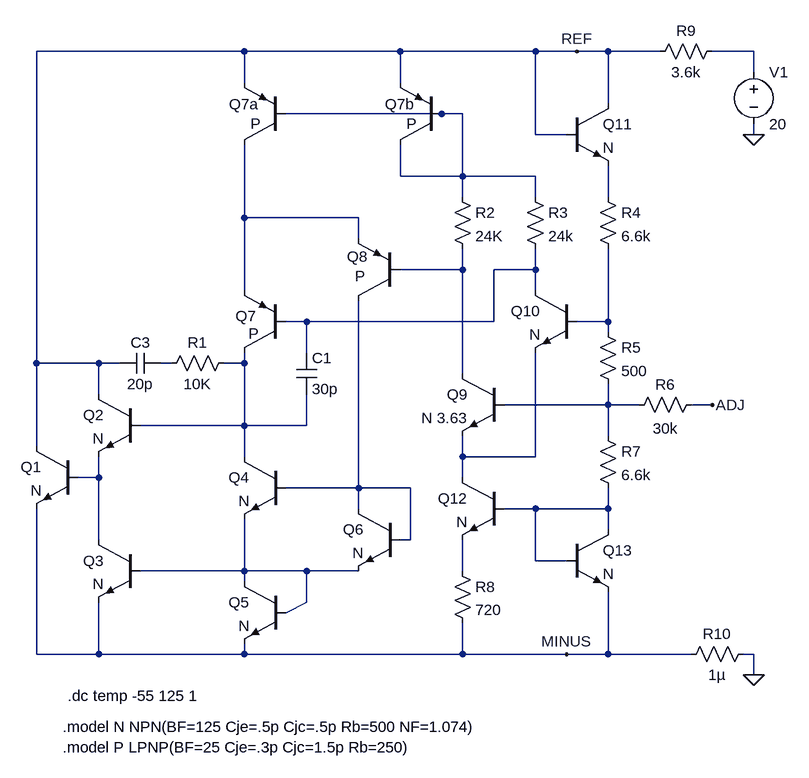
[diagram p0: schematic LT1009_rough_guess1.asc]
LT1009_rough_guess1.asc, the LTspice schematic file:
Version 4
SHEET 1 1268 716
WIRE -256 112 -256 -368
WIRE -256 240 -256 112
WIRE -256 560 -256 336
WIRE -160 112 -256 112
WIRE -160 160 -160 112
WIRE -160 288 -192 288
WIRE -160 288 -160 256
WIRE -160 384 -160 288
WIRE -160 560 -256 560
WIRE -160 560 -160 480
WIRE -128 112 -160 112
WIRE -48 112 -64 112
WIRE 64 -368 -256 -368
WIRE 64 -320 64 -368
WIRE 64 -112 64 -224
WIRE 64 0 64 -112
WIRE 64 112 32 112
WIRE 64 112 64 96
WIRE 64 208 -96 208
WIRE 64 208 64 112
WIRE 64 256 64 208
WIRE 64 432 -96 432
WIRE 64 432 64 352
WIRE 64 448 64 432
WIRE 64 560 -160 560
WIRE 64 560 64 544
WIRE 160 48 128 48
WIRE 160 96 160 48
WIRE 160 208 64 208
WIRE 160 208 160 160
WIRE 160 432 64 432
WIRE 160 480 128 496
WIRE 160 480 160 432
WIRE 240 -112 64 -112
WIRE 240 -80 240 -112
WIRE 240 304 128 304
WIRE 240 304 240 16
WIRE 240 336 240 304
WIRE 240 432 160 432
WIRE 304 -368 64 -368
WIRE 304 -320 304 -368
WIRE 304 -176 304 -224
WIRE 320 304 240 304
WIRE 320 384 304 384
WIRE 320 384 320 304
WIRE 368 -272 128 -272
WIRE 400 -272 368 -272
WIRE 400 -176 304 -176
WIRE 400 -176 400 -272
WIRE 400 -144 400 -176
WIRE 400 -32 304 -32
WIRE 400 -32 400 -64
WIRE 400 128 400 -32
WIRE 400 256 400 224
WIRE 400 288 400 256
WIRE 400 432 400 384
WIRE 400 560 64 560
WIRE 400 560 400 512
WIRE 448 48 160 48
WIRE 448 48 448 -32
WIRE 512 -368 304 -368
WIRE 512 -240 512 -368
WIRE 512 -176 400 -176
WIRE 512 -144 512 -176
WIRE 512 -32 448 -32
WIRE 512 -32 512 -64
WIRE 512 0 512 -32
WIRE 512 256 400 256
WIRE 512 256 512 96
WIRE 512 336 464 336
WIRE 512 416 512 336
WIRE 560 -240 512 -240
WIRE 560 416 512 416
WIRE 560 560 400 560
WIRE 576 -368 512 -368
WIRE 624 -368 576 -368
WIRE 624 -288 624 -368
WIRE 624 -144 624 -192
WIRE 624 48 576 48
WIRE 624 48 624 -64
WIRE 624 64 624 48
WIRE 624 176 464 176
WIRE 624 176 624 144
WIRE 624 224 624 176
WIRE 624 336 512 336
WIRE 624 336 624 304
WIRE 624 368 624 336
WIRE 624 560 560 560
WIRE 624 560 624 464
WIRE 672 176 624 176
WIRE 704 -368 624 -368
WIRE 752 560 624 560
WIRE 784 176 752 176
WIRE 848 -368 784 -368
WIRE 848 -336 848 -368
WIRE 848 -240 848 -256
WIRE 848 560 832 560
WIRE 848 592 848 560
FLAG 848 592 0
FLAG 784 176 ADJ
FLAG 848 -240 0
FLAG 576 -368 REF
FLAG 560 560 MINUS
SYMBOL npn -192 240 M0
SYMATTR InstName Q1
SYMATTR Value N
SYMBOL npn -96 160 M0
SYMATTR InstName Q2
SYMATTR Value N
SYMBOL npn -96 384 M0
SYMATTR InstName Q3
SYMATTR Value N
SYMBOL npn 128 256 M0
SYMATTR InstName Q4
SYMATTR Value N
SYMBOL npn 128 448 M0
SYMATTR InstName Q5
SYMATTR Value N
SYMBOL npn 304 336 M0
SYMATTR InstName Q6
SYMATTR Value N
SYMBOL npn 560 -288 R0
SYMATTR InstName Q11
SYMATTR Value N
SYMBOL npn 464 288 M0
SYMATTR InstName Q12
SYMATTR Value N
SYMBOL npn 560 368 R0
SYMATTR InstName Q13
SYMATTR Value N
SYMBOL npn 576 0 M0
SYMATTR InstName Q10
SYMATTR Value N
SYMBOL npn 464 128 M0
SYMATTR InstName Q9
SYMATTR Value N 3.63
SYMBOL pnp 128 96 R180
WINDOW 0 45 57 Left 0
WINDOW 3 42 30 Left 0
SYMATTR InstName Q7
SYMATTR Value P
SYMBOL pnp 304 16 R180
WINDOW 0 50 68 Left 0
WINDOW 3 54 38 Left 0
SYMATTR InstName Q8
SYMATTR Value P
SYMBOL res 48 96 R90
WINDOW 0 0 56 VBottom 0
WINDOW 3 32 56 VTop 0
SYMATTR InstName R1
SYMATTR Value 10K
SYMATTR SpiceLine tol=1 pwr=0.1
SYMBOL res 384 -160 R0
SYMATTR InstName R2
SYMATTR Value 24K
SYMATTR SpiceLine tol=1 pwr=0.1
SYMBOL res 496 -160 R0
SYMATTR InstName R3
SYMATTR Value 24k
SYMATTR SpiceLine tol=1 pwr=0.1
SYMBOL res 608 -160 R0
SYMATTR InstName R4
SYMATTR Value 6.6k
SYMATTR SpiceLine tol=1 pwr=0.1
SYMBOL res 608 48 R0
SYMATTR InstName R5
SYMATTR Value 500
SYMATTR SpiceLine tol=1 pwr=0.1
SYMBOL res 768 160 R90
WINDOW 0 0 56 VBottom 0
WINDOW 3 37 56 VTop 0
SYMATTR InstName R6
SYMATTR Value 30k
SYMATTR SpiceLine tol=1 pwr=0.1
SYMBOL res 608 208 R0
SYMATTR InstName R7
SYMATTR Value 6.6k
SYMATTR SpiceLine tol=1 pwr=0.1
SYMBOL res 384 416 R0
SYMATTR InstName R8
SYMATTR Value 720
SYMATTR SpiceLine tol=1 pwr=0.1
SYMBOL voltage 848 -352 R0
WINDOW 123 0 0 Left 0
WINDOW 39 0 0 Left 0
SYMATTR Value 20
SYMATTR InstName V1
SYMBOL res 800 -384 R90
WINDOW 0 0 56 VBottom 0
WINDOW 3 32 56 VTop 0
SYMATTR InstName R9
SYMATTR Value 3.6k
SYMATTR SpiceLine tol=1 pwr=0.1
SYMBOL pnp 368 -224 R180
WINDOW 0 42 63 Left 0
WINDOW 3 39 33 Left 0
SYMATTR InstName Q7b
SYMATTR Value P
SYMBOL pnp 128 -224 R180
WINDOW 0 42 63 Left 0
WINDOW 3 39 33 Left 0
SYMATTR InstName Q7a
SYMATTR Value P
SYMBOL res 736 576 R270
WINDOW 0 32 56 VTop 0
WINDOW 3 0 56 VBottom 0
SYMATTR InstName R10
SYMATTR Value 1µ
SYMBOL cap -128 128 R270
WINDOW 0 32 32 VTop 0
WINDOW 3 0 32 VBottom 0
SYMATTR InstName C3
SYMATTR Value 20p
SYMBOL cap 144 96 R0
SYMATTR InstName C1
SYMATTR Value 30p
TEXT -216 672 Left 0 !.model N NPN(BF=125 Cje=.5p Cjc=.5p Rb=500 NF=1.074)\n.model P LPNP(BF=25 Cje=.3p Cjc=1.5p Rb=250)
TEXT -208 624 Left 0 !.dc temp -55 125 1

The netlist it stands for:
* LT1009_rough_guess1.asc
Q1 REF N001 MINUS 0 N
Q2 REF N004 N001 0 N
Q3 N001 N005 MINUS 0 N
Q4 N004 N007 N005 0 N
Q5 N005 N005 MINUS 0 N
Q6 N007 N007 N005 0 N
Q11 REF REF N013 0 N
Q12 N010 N012 N011 0 N
Q13 N012 N012 MINUS 0 N
Q10 N006 N014 N010 0 N
Q9 N009 N015 N010 0 N 3.63
Q7 N004 N006 N003 0 P
Q8 N007 N009 N003 0 P
R1 N004 N002 10K tol=1 pwr=0.1
R2 N008 N009 24K tol=1 pwr=0.1
R3 N008 N006 24k tol=1 pwr=0.1
R4 N013 N014 6.6k tol=1 pwr=0.1
R5 N014 N015 500 tol=1 pwr=0.1
R6 ADJ N015 30k tol=1 pwr=0.1
R7 N015 N012 6.6k tol=1 pwr=0.1
R8 N011 MINUS 720 tol=1 pwr=0.1
V1 N016 0 20
R9 N016 REF 3.6k tol=1 pwr=0.1
Q7b N008 N008 REF 0 P
Q7a N003 N008 REF 0 P
R10 MINUS 0 1µ
C3 REF N002 20p
C1 N006 N004 30p
.model NPN NPN
.model PNP PNP
.lib standard.bjt
.model N NPN(BF=125 Cje=.5p Cjc=.5p Rb=500 NF=1.074)
.model P LPNP(BF=25 Cje=.3p Cjc=1.5p Rb=250)
.dc temp -55 125 1
.backanno
.end